# Altium schematic sheet SOC-Bootstrap.SchDoc
size A3; DocumentNumber: 9; SheetNumber: 10; SheetTotal: 14
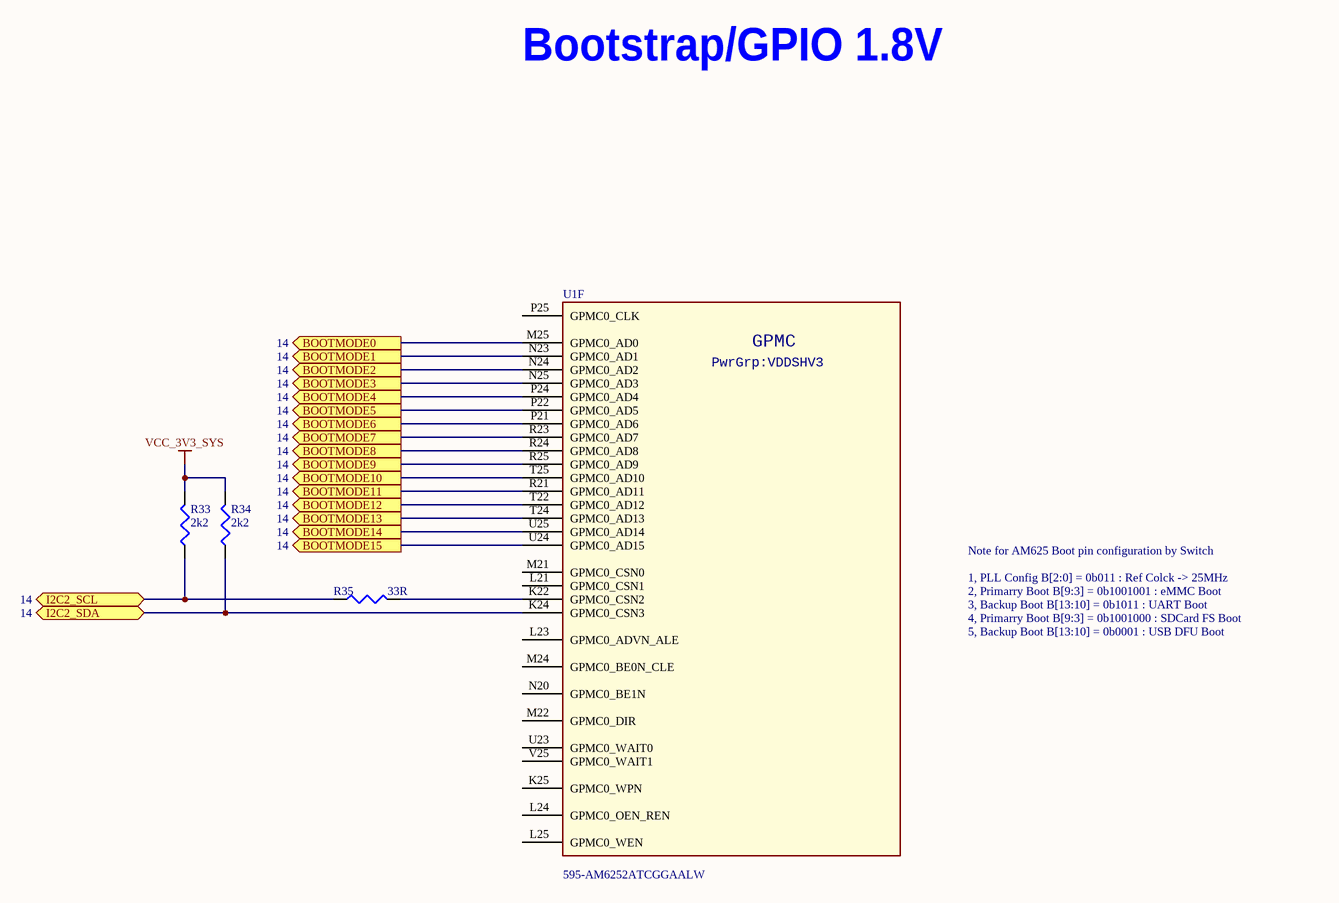
[diagram p0: SOC-Bootstrap.SchDoc]

## Parts
R33  2k2  [R0402]
R34  2k2  [R0402]
R35  33R  [R0201]
U1  Supplier Part Number 1: 595-AM6252ATCGGAALW  [BGA425C50P25X25_1300X1300X89]  (hidden comment: AM62-EVM_BGA425)  (part F of 18)

## Ports
BOOTMODE0 (out, see 14), BOOTMODE1 (out, see 14), BOOTMODE2 (out, see 14), BOOTMODE3 (out, see 14), BOOTMODE4 (out, see 14), BOOTMODE5 (out, see 14), BOOTMODE6 (out, see 14), BOOTMODE7 (out, see 14), BOOTMODE8 (out, see 14), BOOTMODE9 (out, see 14), BOOTMODE10 (out, see 14), BOOTMODE11 (out, see 14), BOOTMODE12 (out, see 14), BOOTMODE13 (out, see 14), BOOTMODE14 (out, see 14), BOOTMODE15 (out, see 14), I2C2_SCL (bidir, see 14), I2C2_SDA (bidir, see 14)

## Nets
VCC_3V3_SYS: R33.2 R34.2
BOOTMODE0: U1.M25(GPMC0_AD0) ; port BOOTMODE0
BOOTMODE1: U1.N23(GPMC0_AD1) ; port BOOTMODE1
BOOTMODE2: U1.N24(GPMC0_AD2) ; port BOOTMODE2
BOOTMODE3: U1.N25(GPMC0_AD3) ; port BOOTMODE3
BOOTMODE4: U1.P24(GPMC0_AD4) ; port BOOTMODE4
BOOTMODE5: U1.P22(GPMC0_AD5) ; port BOOTMODE5
BOOTMODE6: U1.P21(GPMC0_AD6) ; port BOOTMODE6
BOOTMODE7: U1.R23(GPMC0_AD7) ; port BOOTMODE7
BOOTMODE8: U1.R24(GPMC0_AD8) ; port BOOTMODE8
BOOTMODE9: U1.R25(GPMC0_AD9) ; port BOOTMODE9
BOOTMODE10: U1.T25(GPMC0_AD10) ; port BOOTMODE10
BOOTMODE11: U1.R21(GPMC0_AD11) ; port BOOTMODE11
BOOTMODE12: U1.T22(GPMC0_AD12) ; port BOOTMODE12
BOOTMODE13: U1.T24(GPMC0_AD13) ; port BOOTMODE13
BOOTMODE14: U1.U25(GPMC0_AD14) ; port BOOTMODE14
BOOTMODE15: U1.U24(GPMC0_AD15) ; port BOOTMODE15
I2C2_SCL: R33.1 R35.1 ; port I2C2_SCL
I2C2_SDA: R34.1 U1.K24(GPMC0_CSN3) ; port I2C2_SDA
NetR35_2: R35.2 U1.K22(GPMC0_CSN2)

Not connected (* = marked no-connect by the designer): U1 K25(GPMC0_WPN) L21(GPMC0_CSN1) L23(GPMC0_ADVN_ALE) L24(GPMC0_OEN_REN) L25(GPMC0_WEN) M21(GPMC0_CSN0) M22(GPMC0_DIR) M24(GPMC0_BE0N_CLE) N20(GPMC0_BE1N) P25(GPMC0_CLK) U23(GPMC0_WAIT0) V25(GPMC0_WAIT1)

## Notes on the sheet
- Bootstrap/GPIO 1.8V
- Note for AM625 Boot pin configuration by Switch
- 1, PLL Config B[2:0] = 0b011 : Ref Colck -> 25MHz
- 2, Primarry Boot B[9:3] = 0b1001001 : eMMC Boot
- 3, Backup Boot B[13:10] = 0b1011 : UART Boot
- 4, Primarry Boot B[9:3] = 0b1001000 : SDCard FS Boot
- 5, Backup Boot B[13:10] = 0b0001 : USB DFU Boot
- (in symbol AM62-EVM_BGA425, part F) GPMC; PwrGrp:VDDSHV3

## Library data of the parts
R33 R34 = RC0402FR-072K2L: RES 2.20K OHM 1/16W 1% 0402 SMD; Manufacturer: Yageo; Resistance (Ohms): 2.2K; Power (Watts): 0.063W, 1/16W; .Checked PCB: used; Temperature Coefficient: ±100ppm/°C; Category: Resistors; Supplier Part Number: 311-2.20KLRCT-ND; Manufacturer Part Number: RC0402FR-072K2L; Package / Case: 0402 (1005 Metric); Price 1k [$]: 0.01421; Tolerance: ±1%; Value: 2k2; .Checked SCH: used; Supplier: Digikey; Supplier 1: Digi-Key; Supplier Part Number 1: 311-2.20KLRCT-ND; RoHS: RoHS Compliant; Stock 1: 195154; Pricing 1: 10=0.014, 50=0.0104, 100=0.0079, 250=0.00584, 500=0.00432, 1000=0.00288 (USD); Composition: Thick Film; Features: -; Size / Dimension: 0.039" L x 0.020" W (1.00mm x 0.50mm); Height: 0.016" (0.40mm); Number of Terminations: 2; Packaging: Cut Tape (CT); ComponentLink1URL: http://www.yageo.com/documents/recent/PYu-RC0402_51_RoHS_L_6.pdf; ComponentLink1Description: http://www.yageo.com/documents/recent/PYu-RC0402_51_RoHS_L_6.pdf
R35 = RC0201FR-0733RL: RES 33 OHM 1% 1/20W 0201; Manufacturer: Yageo; Power Rating: 50mW; Voltage Rating: 25V; Temperature Coefficient: 200ppm/°C; Supplier 1: Digi-Key; Manufacturer Part Number: RC0201FR-0733RL; Stock 1: 4610000; Pricing 1: 10000=0.0053, 50000=0.0042, 100000=0.0038 (USD); Case/Package: 0201; Case Code (Metric): 0603; Case Code (Imperial): 0201; Size Code: 0201; Min Operating Temperature: -55°C; Max Operating Temperature: 125°C; Resistance: 33R; Tolerance: 1%; Package Quantity: 1; Packaging: Cut Tape; Resistor Type: Thick Film; Number of Terminations: 2; Termination: SMD/SMT; Max Power Dissipation: 50mW; Features: Moisture Resistant; Series: RC; Resistance Tolerance: 1%; Length: 0.024inch; Width: 0.012inch; Height: 0.01inch; Lead Free: Lead Free; RoHS Compliant: Yes; ComponentLink1URL: https://datasheet.ciiva.com/7672/1563626-7672223.pdf?src-supplier=Element14; ComponentLink1Description: https://datasheet.ciiva.com/7672/1563626-7672223.pdf?src-supplier=Element14; ComponentLink2URL: https://datasheet.ciiva.com/22698/1563626-22698520.pdf?src-supplier=Element14; ComponentLink2Description: https://datasheet.ciiva.com/22698/1563626-22698520.pdf?src-supplier=Element14; ComponentLink3URL: https://datasheet.ciiva.com/2560/pyu-r-int-thick-7-2560878.pdf?src-supplier=Digi-Key; ComponentLink3Description: https://datasheet.ciiva.com/2560/pyu-r-int-thick-7-2560878.pdf?src-supplier=Digi-Key; ComponentLink4URL: https://datasheet.ciiva.com/2560/pyu-r-int-thick-7-2560879.pdf?src-supplier=Digi-Key; ComponentLink4Description: https://datasheet.ciiva.com/2560/pyu-r-int-thick-7-2560879.pdf?src-supplier=Digi-Key; ComponentLink5URL: https://datasheet.ciiva.com/2560/pyu-r-int-thick-7-2560877.pdf?src-supplier=Digi-Key; ComponentLink5Description: https://datasheet.ciiva.com/2560/pyu-r-int-thick-7-2560877.pdf?src-supplier=Digi-Key; Supplier Part Number 1: 311-33.0MTR-ND
U1 = AM62-EVM_BGA425: ARM® Cortex®-A53 Microprocessor IC Sitara™ 2 Core, 64-Bit 1.4GHz 425-FCCSP (13x13); Manufacturer: Texas Instruments; Manufacturer Part Number: AM6252ATCGGAALW; Supplier 1: Mouser; Stock 1: 0; Pricing 1: 1=21.23, 10=19.58, 50=18.7, 100=18.7, 1000=15.94, 10000=15.94 (USD)